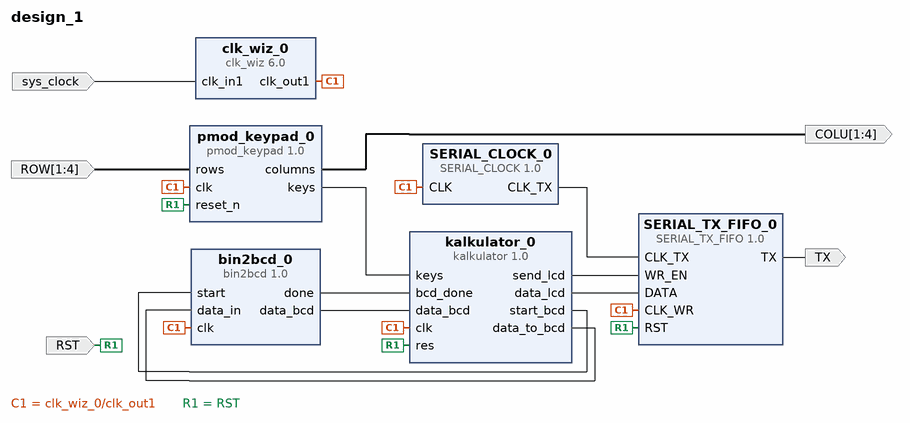
[diagram p0: block diagram of the top level]
# Vivado block design design_1, xc7z020clg400-1, Vivado 2020.1
create_bd_design design_1

create_bd_port -dir I -type clk sys_clock
set_property -dict {CONFIG.FREQ_HZ 125000000 CONFIG.PHASE 0.000} [get_bd_ports sys_clock]
create_bd_port -dir O -from 1 -to 4 COLU
create_bd_port -dir I -from 1 -to 4 ROW
create_bd_port -dir O TX
create_bd_port -dir I RST

create_bd_cell -type ip -vlnv xilinx.com:ip:clk_wiz:6.0 clk_wiz_0
set_property -dict [list \
  CONFIG.CLKOUT1_JITTER 143.688 \
  CONFIG.CLKOUT1_REQUESTED_OUT_FREQ 50.000 \
  CONFIG.CLK_IN1_BOARD_INTERFACE sys_clock \
  CONFIG.MMCM_CLKOUT0_DIVIDE_F 20.000 \
  CONFIG.USE_BOARD_FLOW true \
  CONFIG.USE_LOCKED false \
  CONFIG.USE_RESET false \
] [get_bd_cells clk_wiz_0]
create_bd_cell -type ip -vlnv xilinx.com:user:SERIAL_CLOCK:1.0 SERIAL_CLOCK_0
set_property -dict {CONFIG.K 3221 CONFIG.N 20} [get_bd_cells SERIAL_CLOCK_0]
create_bd_cell -type ip -vlnv xilinx.com:user:SERIAL_TX_FIFO:1.0 SERIAL_TX_FIFO_0
create_bd_cell -type ip -vlnv xilinx.com:user:kalkulator:1.0 kalkulator_0
create_bd_cell -type ip -vlnv user.org:user:pmod_keypad:1.0 pmod_keypad_0
create_bd_cell -type ip -vlnv user.org:user:bin2bcd:1.0 bin2bcd_0
set_property -dict {CONFIG.NO_BCD_DIGITS 3 CONFIG.NO_BITS_IN 8} [get_bd_cells bin2bcd_0]

# ---- connections ----

connect_bd_net [get_bd_ports sys_clock] [get_bd_pins clk_wiz_0/clk_in1]
connect_bd_net [get_bd_pins SERIAL_CLOCK_0/CLK_TX] [get_bd_pins SERIAL_TX_FIFO_0/CLK_TX]
connect_bd_net [get_bd_pins clk_wiz_0/clk_out1] \
  [get_bd_pins kalkulator_0/clk] [get_bd_pins bin2bcd_0/clk] [get_bd_pins SERIAL_CLOCK_0/CLK] [get_bd_pins pmod_keypad_0/clk] \
  [get_bd_pins SERIAL_TX_FIFO_0/CLK_WR]
connect_bd_net [get_bd_pins kalkulator_0/start_bcd] [get_bd_pins bin2bcd_0/start]
connect_bd_net [get_bd_pins kalkulator_0/data_to_bcd] [get_bd_pins bin2bcd_0/data_in]
connect_bd_net [get_bd_pins kalkulator_0/send_lcd] [get_bd_pins SERIAL_TX_FIFO_0/WR_EN]
connect_bd_net [get_bd_ports RST] [get_bd_pins pmod_keypad_0/reset_n] [get_bd_pins SERIAL_TX_FIFO_0/RST] [get_bd_pins kalkulator_0/res]
connect_bd_net [get_bd_pins bin2bcd_0/done] [get_bd_pins kalkulator_0/bcd_done]
connect_bd_net [get_bd_pins pmod_keypad_0/keys] [get_bd_pins kalkulator_0/keys]
connect_bd_net [get_bd_pins bin2bcd_0/data_bcd] [get_bd_pins kalkulator_0/data_bcd]
connect_bd_net [get_bd_pins pmod_keypad_0/columns] [get_bd_ports COLU]
connect_bd_net -net rows_0_1 [get_bd_ports ROW] [get_bd_pins pmod_keypad_0/rows]
connect_bd_net [get_bd_pins SERIAL_TX_FIFO_0/TX] [get_bd_ports TX]
connect_bd_net [get_bd_pins kalkulator_0/data_lcd] [get_bd_pins SERIAL_TX_FIFO_0/DATA]

validate_bd_design
save_bd_design
